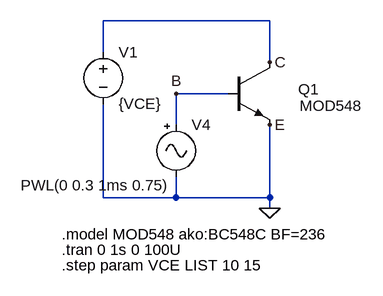
[diagram p0: schematic CircuitoSegundaParte.asc]
CircuitoSegundaParte.asc, the LTspice schematic file:
Version 4
SHEET 1 880 712
WIRE 256 144 0 144
WIRE 0 192 0 144
WIRE 256 208 256 144
WIRE 192 256 112 256
WIRE 112 304 112 256
WIRE 0 416 0 272
WIRE 112 416 112 384
WIRE 112 416 0 416
WIRE 256 416 256 304
WIRE 256 416 112 416
WIRE 256 432 256 416
FLAG 256 208 C
FLAG 112 256 B
FLAG 256 432 0
FLAG 256 304 E
SYMBOL npn 192 208 R0
WINDOW 0 108 41 Left 2
WINDOW 3 110 67 Left 2
SYMATTR InstName Q1
SYMATTR Value MOD548
SYMBOL voltage 0 176 R0
WINDOW 123 0 0 Left 0
WINDOW 39 0 0 Left 0
SYMATTR InstName V1
SYMATTR Value {VCE}
SYMBOL Misc\\signal 112 288 R0
WINDOW 3 -239 109 Left 2
WINDOW 123 0 0 Left 0
WINDOW 39 0 0 Left 0
SYMATTR Value PWL(0 0.3 1ms 0.75)
SYMATTR InstName V4
TEXT -64 472 Left 2 !.model MOD548 ako:BC548C BF=236
TEXT -64 496 Left 2 !.tran 0 1s 0 100U
TEXT -64 520 Left 2 !.step param VCE LIST 10 15

The netlist it stands for:
* CircuitoSegundaParte.asc
Q1 C B 0 0 MOD548
V1 C 0 {VCE}
V4 B 0 PWL(0 0.3 1ms 0.75)
.model NPN NPN
.model PNP PNP
.lib standard.bjt
.model MOD548 ako:BC548C BF=236
.tran 0 1s 0 100U
.step param VCE LIST 10 15
.backanno
.end